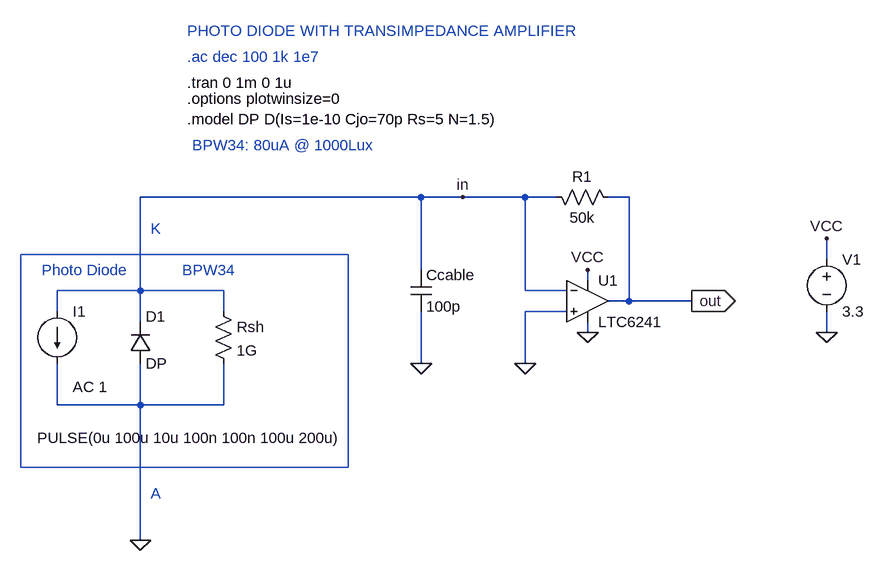
[diagram p0: schematic BPW34.asc]
BPW34.asc, the LTspice schematic file:
Version 4
SHEET 1 1224 680
WIRE 80 112 -352 112
WIRE 144 112 80 112
WIRE 240 112 144 112
WIRE 288 112 240 112
WIRE 400 112 368 112
WIRE 704 208 704 176
WIRE 80 224 80 112
WIRE 336 240 336 224
WIRE -352 256 -352 112
WIRE -352 256 -480 256
WIRE -224 256 -352 256
WIRE 240 256 240 112
WIRE 304 256 240 256
WIRE 400 272 400 112
WIRE 400 272 368 272
WIRE 496 272 400 272
WIRE -480 288 -480 256
WIRE -224 288 -224 256
WIRE 304 288 240 288
WIRE -352 304 -352 256
WIRE 336 320 336 304
WIRE 704 320 704 288
WIRE 80 368 80 288
WIRE 240 368 240 288
WIRE -480 432 -480 368
WIRE -352 432 -352 368
WIRE -352 432 -480 432
WIRE -224 432 -224 368
WIRE -224 432 -352 432
WIRE -352 640 -352 432
FLAG 240 368 0
FLAG 336 224 VCC
FLAG 704 320 0
FLAG 704 176 VCC
FLAG 80 368 0
FLAG -352 640 0
FLAG 496 272 out
IOPIN 496 272 Out
FLAG 144 112 in
FLAG 336 320 0
SYMBOL cap 64 224 R0
SYMATTR InstName Ccable
SYMATTR Value 100p
SYMBOL res 384 128 M270
WINDOW 0 32 56 VTop 2
WINDOW 3 0 56 VBottom 2
SYMATTR InstName R1
SYMATTR Value 50k
SYMBOL voltage 704 192 R0
WINDOW 123 24 132 Left 0
WINDOW 39 0 0 Left 0
SYMATTR InstName V1
SYMATTR Value 3.3
SYMBOL diode -368 368 M180
WINDOW 0 24 72 Left 2
WINDOW 3 24 0 Left 2
SYMATTR InstName D1
SYMATTR Value DP
SYMBOL current -480 288 R0
WINDOW 3 -31 195 Left 2
WINDOW 123 24 116 Left 2
WINDOW 39 0 0 Left 0
SYMATTR Value PULSE(0u 100u 10u 100n 100n 100u 200u)
SYMATTR Value2 AC 1
SYMATTR InstName I1
SYMBOL res -240 272 R0
WINDOW 0 36 40 Left 2
WINDOW 3 36 76 Left 2
SYMATTR InstName Rsh
SYMATTR Value 1G
SYMBOL Opamps\\LTC6241 336 272 R0
WINDOW 0 16 -32 Left 2
WINDOW 3 16 32 Left 2
SYMATTR InstName U1
TEXT -280 -64 Left 2 !.tran 0 1m 0 1u
TEXT -280 -40 Left 2 !.options plotwinsize=0
TEXT -280 -104 Left 2 ;.ac dec 100 1k 1e7
TEXT -280 -8 Left 2 !.model DP D(Is=1e-10 Cjo=70p Rs=5 N=1.5)
TEXT -280 -144 Left 2 ;PHOTO DIODE WITH TRANSIMPEDANCE AMPLIFIER
TEXT -504 224 Left 2 ;Photo Diode
TEXT -336 160 Left 2 ;K
TEXT -336 568 Left 2 ;A
TEXT -288 224 Left 2 ;BPW34
TEXT -272 32 Left 2 ;BPW34: 80uA @ 1000Lux
RECTANGLE Normal -32 528 -536 200

The netlist it stands for:
* BPW34.asc
Ccable in 0 100p
R1 out in 50k
V1 VCC 0 3.3
D1 0 in DP
I1 in 0 PULSE(0u 100u 10u 100n 100n 100u 200u) AC 1
Rsh in 0 1G
XU1 0 in VCC 0 out LTC6241  ; pins In+ In- V+ V- OUT
.model D D
.lib standard.dio
.tran 0 1m 0 1u
.options plotwinsize=0
* .ac dec 100 1k 1e7
.model DP D(Is=1e-10 Cjo=70p Rs=5 N=1.5)
* PHOTO DIODE WITH TRANSIMPEDANCE AMPLIFIER
* Photo Diode
* K
* A
* BPW34
* BPW34: 80uA @ 1000Lux
.lib LTC4.lib
.backanno
.end